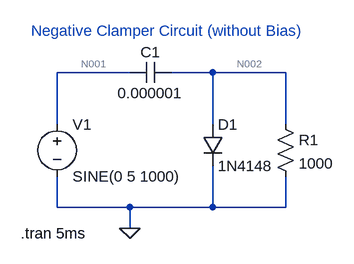
[diagram p0: schematic Assignment 2b (i).asc]
Assignment 2b (i).asc, the LTspice schematic file:
Version 4.1
SHEET 1 880 680
WIRE 176 80 64 80
WIRE 304 80 240 80
WIRE 416 80 304 80
WIRE 64 160 64 80
WIRE 304 160 304 80
WIRE 416 160 416 80
WIRE 64 288 64 240
WIRE 176 288 64 288
WIRE 304 288 304 224
WIRE 304 288 176 288
WIRE 416 288 416 240
WIRE 416 288 304 288
WIRE 176 320 176 288
FLAG 176 320 0
SYMBOL voltage 64 144 R0
WINDOW 123 0 0 Left 0
WINDOW 39 0 0 Left 0
SYMATTR InstName V1
SYMATTR Value SINE(0 5 1000)
SYMBOL res 400 144 R0
SYMATTR InstName R1
SYMATTR Value 1000
SYMBOL cap 240 64 R90
WINDOW 0 0 32 VBottom 2
WINDOW 3 32 32 VTop 2
SYMATTR InstName C1
SYMATTR Value 0.000001
SYMBOL diode 288 160 R0
SYMATTR InstName D1
SYMATTR Value 1N4148
TEXT 8 328 Left 2 !.tran 5ms
TEXT 24 16 Left 2 ;Negative Clamper Circuit (without Bias)

The netlist it stands for:
* Assignment 2b (i).asc
V1 N001 0 SINE(0 5 1000)
R1 N002 0 1000
C1 N002 N001 0.000001
D1 N002 0 1N4148
.model D D
.lib standard.dio
.tran 5ms
* Negative Clamper Circuit (without Bias)
.backanno
.end

* Results of the author's LTspice run, read from the files saved beside the schematic
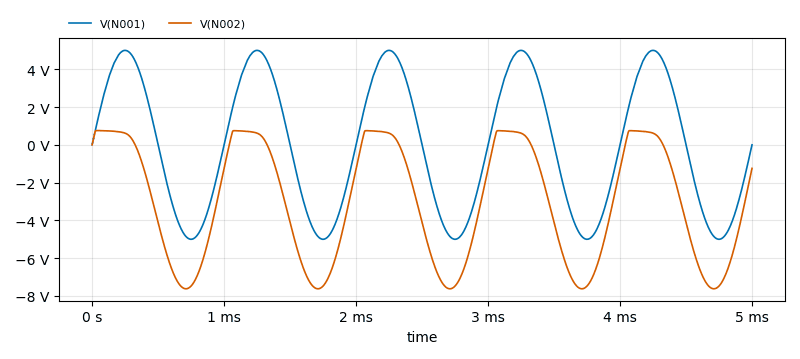
[diagram p1: Transient Analysis of Assignment 2b (i).asc, plotted from the saved traces]
* Transient Analysis, 1 run:
*   V(N001): min -5 V, max 5 V, average -2.341 mV, rms 3.535 V, last 0 V
*   V(N002): min -7.621 V, max 755.2 mV, average -3.032 V, rms 4.351 V, last -1.248 V